# Altium schematic sheet [3]-ADC.SchDoc
size A
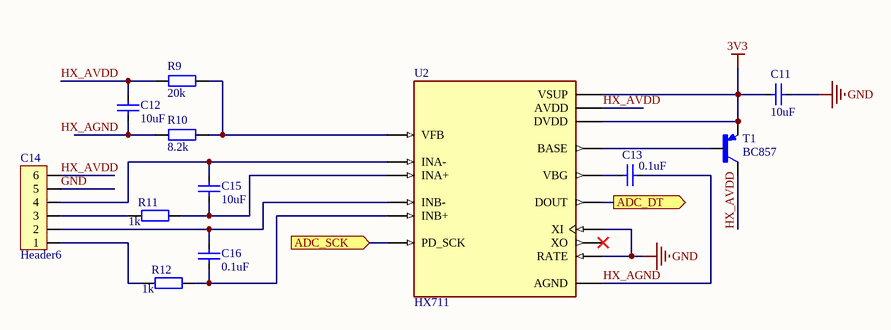
[diagram p0: [3]-ADC.SchDoc]

## Parts
C11  10uF  [CAP_0805]
C12  10uF  [CAP_0805]
C13  0.1uF  [CAP_0805]
C14  Header6  [CON6]
C15  10uF  [CAP_0805]
C16  0.1uF  [CAP_0805]
R9  20k  [RES-SMD-0805]
R10  8.2k  [RES-SMD-0805]
R11  1k  [RES-SMD-0805]
R12  1k  [RES-SMD-0805]
T1  BC857  [SOT23-BEC]
U2  HX711  [SOP127P600X180-16N]

## Ports
ADC_DT (out), ADC_SCK (in)

## Nets
3V3: C11.2 T1.E U2.1(VSUP) U2.16(DVDD)
GND: C11.1 C14.5 U2.14(XI) U2.15(RATE)
ADC_DT: U2.12(DOUT) ; port ADC_DT
ADC_SCK: U2.11(PD_SCK) ; port ADC_SCK
HX_AGND: C13.1 U2.5(AGND)
HX_AVDD: C12.2 C14.6 R9.1 T1.C U2.3(AVDD)
NetC12_1: C12.1 R10.1
NetC13_2: C13.2 U2.6(VBG)
NetC14_1: C14.1 R12.1
NetC14_2: C14.2 C16.2 U2.9(INB-)
NetC14_3: C14.3 R11.1
NetC14_4: C14.4 C15.2 U2.7(INA-)
NetC15_1: C15.1 R11.2 U2.8(INA+)
NetC16_1: C16.1 R12.2 U2.10(INB+)
NetR9_2: R9.2 R10.2 U2.4(VFB)
NetT1_B: T1.B U2.2(BASE)

Not connected (* = marked no-connect by the designer): U2 13(XO)*

## Notes on the sheet
- Labels drawn without touching a wire or pin: HX_AGND

## Library data of the parts
C11-C13 C15 C16 = CapSMD: Capacitor; Value: 33p; Published: 8-Jun-2000; LatestRevisionDate: 17-Jul-2002; LatestRevisionNote: Re-released for DXP Platform.; PackageReference: RAD-0.3; Publisher: Altium Limited
C14 = Header6: Header IDC, 6 x 1 Pin Vertical 2.54mm Pitch (Non-Boxed, Male); Manufacturer: W¨¹rth Elektronik eiSos GmbH; partNo: 613002143121; ComponentLink1 Description: Manufacturer; ComponentLink2 Description: Datasheet; NoPins: 02; Created Date: 29 March 2013; ComponentLink1URL: http://www.we-online.com; ComponentLink2URL: http://katalog.we-online.de/em/datasheet/6130xx143121.pdf; Created by: Karrer Zheng
R9-R12 = Resistor - SMD: Resistor SMD; Manufacturer: Generic Components; Class: Passive; Published: 08/06/2000; Publisher: Altium Hobart Technology Centre
T1 = BC857: Transistor PNP BC857 PHILIPS Ampere=1 V=30 SO; MF: Nexperia USA; Package: SOT-23 NXP Semiconductors; Value: *; Price: None; MP: BC857; SnapEDA_Link: https://www.snapeda.com/parts/BC857/Nexperia%20USA%20Inc./view-part/53064/?ref=snap; Availability: Unavailable
U2 = HX711: Precision 24-bit analog-to-digital converter (ADC) designed for weigh scales and industrial control applications to interface directly with a bridge sensor.; MF: AVIA SEMICONDUCTOR; MP: HX711; Value: *; Availability: Not in stock; Package: None; SnapEDA_Link: https://www.snapeda.com/parts/HX711/AVIA+SEMICONDUCTOR/view-part/?ref=snap; Price: None; Check_prices: https://www.snapeda.com/parts/HX711/AVIA+SEMICONDUCTOR/view-part/?ref=eda